# EAGLE schematic siren (EAGLE 7.5.0)
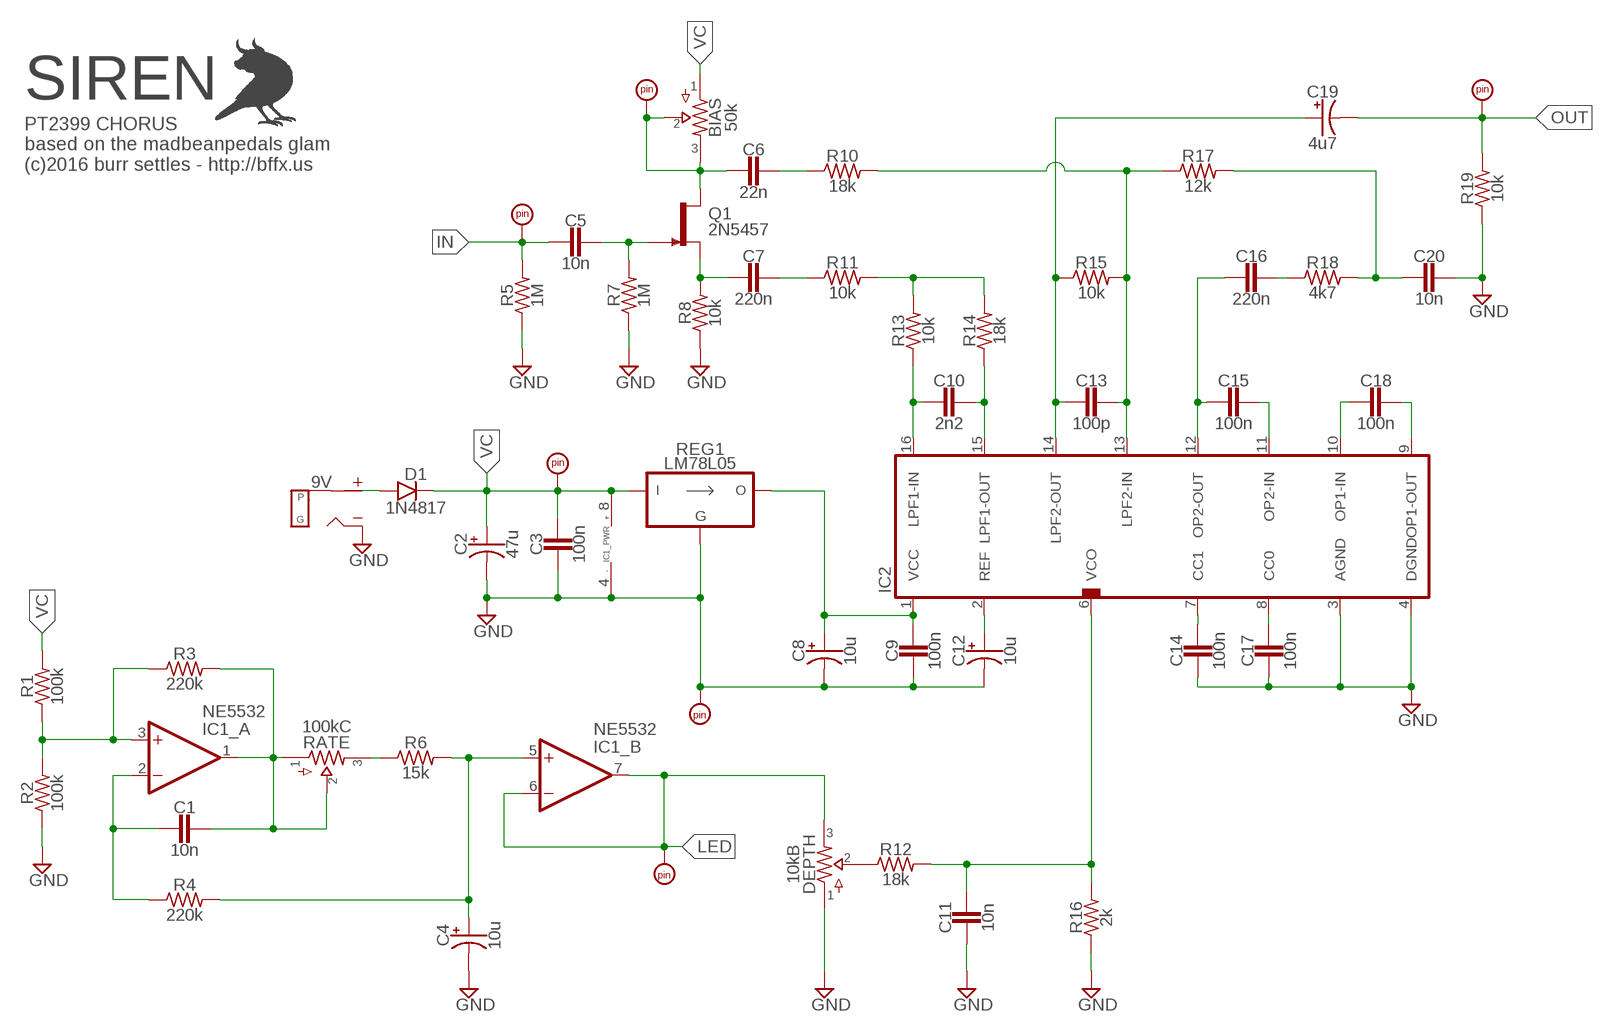
[diagram p0: schematic, sheet 1]

## Parts
9V  DC_MONO  [DC]
BIAS  50k  POTSTRIM  [2262_TRIM]
C1  10n  CER/FILM2  [050X030_025_2]
C2  47u  0501  [050_020_1]
C3  100n  CER/FILM2  [050X030_025_2]
C4  10u  0501  [050_020_1]
C5  10n  CER/FILM2  [050X030_025_2]
C6  22n  CER/FILM2  [050X030_025_2]
C7  220n  CER/FILM2  [050X030_025_2]
C8  10u  0500  [050_020]
C9  100n  CER/FILM2  [050X030_025_2]
C10  2n2  CER/FILM2  [050X030_025_2]
C11  10n  CER/FILM2  [050X030_025_2]
C12  10u  0501  [050_020_1]
C13  100p  CER/FILM2  [050X030_025_2]
C14  100n  CER/FILM2  [050X030_025_2]
C15  100n  CER/FILM2  [050X030_025_2]
C16  220n  CER/FILM2  [050X030_025_2]
C17  100n  CER/FILM2  [050X030_025_2]
C18  100n  CER/FILM2  [050X030_025_2]
C19  4u7  0501  [050_020_1]
C20  10n  CER/FILM2  [050X030_025_2]
D1  1N4817  DO41.3  [DO41-3]
DEPTH  10kB  POTSTRIM  [2262_TRIM]
GND  PADRND  [ROUND]
IC1  NE5532  DUALTH  [DIL08]
IC2  PT2399TH  [DIL16]
IN  PADSQR  [SQUARE]
L+  PADSQR  [SQUARE]
OUT  PADSQR  [SQUARE]
PAD1  PAD  [UNLABELED]
PAD2  PAD  [UNLABELED]
Q1  2N5457  [TO92-]
R1  100k  R_.2  [R0207/2V]
R2  100k  R_.2  [R0207/2V]
R3  220k  R_.2  [R0207/2V]
R4  220k  R_.2  [R0207/2V]
R5  1M  R_.2  [R0207/2V]
R6  15k  R_.2  [R0207/2V]
R7  1M  R_.2  [R0207/2V]
R8  10k  R_.2  [R0207/2V]
R10  18k  R_.2  [R0207/2V]
R11  10k  R_.2  [R0207/2V]
R12  18k  R_.2  [R0207/2V]
R13  10k  R_.2  [R0207/2V]
R14  18k  R_.2  [R0207/2V]
R15  10k  R_.2  [R0207/2V]
R16  2k  R_.2  [R0207/2V]
R17  12k  R_.2  [R0207/2V]
R18  4k7  R_.2  [R0207/2V]
R19  10k  R_.2  [R0207/2V]
RATE  100kC  POTSSMALL_PADS  [PADS_SMALL]
REG1  LM78L05  [TO92-]

## Nets
+9V: 9V.T(TIP) D1.A
GND: 9V.S(SLEEVE) C2.- C3.2 C4.- C8.- C9.2 C11.2 C12.- C14.2 C17.2 C20.1 DEPTH.1 GND.1 IC1.4(_PWR:V-) IC2.3(AGND) IC2.4(DGND) R2.1 R5.1 R7.1 R8.1 R16.1 R19.1 REG1.2(GND)
IN: C5.2 IN.1 R5.2
LED: DEPTH.3 IC1.6(_B:-IN) IC1.7(_B:OUT) L+.1
N$1: C13.1 IC2.13(LPF2-IN) R10.2 R15.2 R17.1
N$3: C8.+ C9.1 IC2.1(VCC) REG1.3(VO)
N$4: C10.2 IC2.16(LPF1-IN) R13.1
N$5: C10.1 IC2.15(LPF1-OUT) R14.1
N$6: C20.2 R17.2 R18.2
N$7: C12.+ IC2.2(REF)
N$8: C14.1 IC2.7(CC1)
N$9: C17.1 IC2.8(CC0)
N$10: C15.1 IC2.11(OP2-IN)
N$11: C18.2 IC2.10(OP1-IN)
N$12: C18.1 IC2.9(OP1-OUT)
N$13: C13.2 C19.+ IC2.14(LPF2-OUT) R15.1
N$15: R11.2 R13.2 R14.2
N$16: C7.1 R11.1
N$17: C7.2 Q1.2(S) R8.2
N$18: C6.1 R10.1
N$19: BIAS.2 BIAS.3 C6.2 PAD2.P$1 Q1.3(D)
N$20: C5.1 Q1.1(G) R7.2
N$21: IC1.3(_A:+IN) R1.1 R2.2 R3.1
N$22: C15.2 C16.2 IC2.12(OP2-OUT)
N$23: C16.1 R18.1
N$24: C1.1 IC1.1(_A:OUT) R3.2 RATE.1 RATE.2
N$25: C1.2 IC1.2(_A:-IN) R4.1
N$26: DEPTH.2 R12.1
N$27: R6.1 RATE.3
N$28: C4.+ IC1.5(_B:+IN) R4.2 R6.2
N$31: C11.1 IC2.6(VCO) R12.2 R16.2
OUT: C19.- OUT.1 R19.2
VC: BIAS.1 C2.+ C3.1 D1.C IC1.8(_PWR:V+) PAD1.P$1 R1.2 REG1.1(VI)

## Notes on the sheet
- SIREN
- PT2399 CHORUS
  based on the madbeanpedals glam
  (c)2016 burr settles - http://bffx.us

## Library data of the parts
9V = jacks:DC_MONO
BIAS DEPTH RATE = potentiometers:POTS
C1 C3 C5-C7 C9-C11 C13-C18 C20 = capacitors-film:CER/FILM: 47 - 120pF Xicon Ceramic Disc 2.5mm lead spacing
C2 C4 C8 C12 C19 = capacitors-elec:050: 0.22 - 100uF Xicon values at Mouser.com: 10V: 10 - 100uF; 16V: 2.2 - 47uF; 25V: 0.47 - 47uF; 50V: 0.22 - 22uF
D1 = diodes:DO41: DO-41 Package Diodes: 1N4001 - 1N40019 Zener Diodes: 1N4728 - 1N4764
GND IN L+ OUT PAD1 PAD2 = supply pins:PAD
IC1 = integrated circuits:DUAL: OP AMP
IC2 = integrated circuits:PT2399: Echo Processor IC
Q1 = transistors:2N5457: N-CHANNEL JFET
R1-R8 R10-R19 = resistors:R_
REG1 = regulators:LM78L05